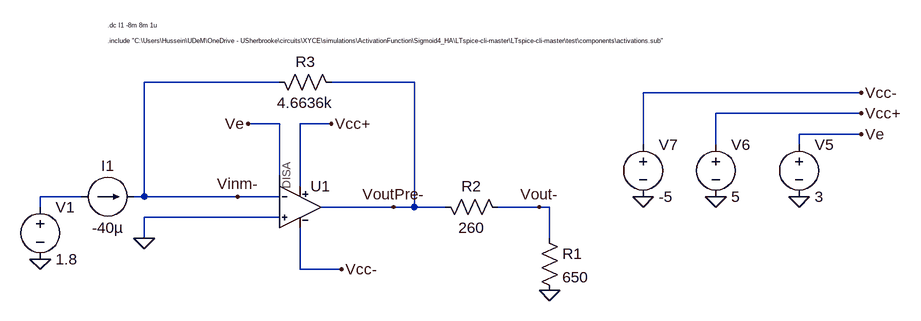
[diagram p0: schematic Test_TIA.asc]
Test_TIA.asc, the LTspice schematic file:
Version 4
SHEET 1 2360 680
WIRE 160 -128 -48 -128
WIRE 368 -128 240 -128
WIRE 1056 -112 720 -112
WIRE 1056 -80 832 -80
WIRE 160 -64 112 -64
WIRE 240 -64 192 -64
WIRE 1056 -48 960 -48
WIRE 720 -32 720 -112
WIRE 832 -32 832 -80
WIRE 960 -32 960 -48
WIRE 160 16 160 -64
WIRE 192 32 192 -64
WIRE -144 48 -208 48
WIRE -48 48 -48 -128
WIRE -48 48 -64 48
WIRE 96 48 -48 48
WIRE 160 48 96 48
WIRE -208 64 -208 48
WIRE 336 64 224 64
WIRE 368 64 368 -128
WIRE 368 64 336 64
WIRE 416 64 368 64
WIRE 560 64 496 64
WIRE 576 64 560 64
WIRE 160 80 -48 80
WIRE -48 112 -48 80
WIRE 576 112 576 64
WIRE 192 160 192 96
WIRE 256 160 192 160
FLAG -48 112 0
FLAG -208 144 0
FLAG 576 192 0
FLAG 560 64 Vout-
FLAG 336 64 VoutPre-
FLAG 96 48 Vinm-
FLAG 960 48 0
FLAG 832 48 0
FLAG 720 48 0
FLAG 1056 -112 Vcc-
FLAG 1056 -80 Vcc+
FLAG 1056 -48 Ve
FLAG 240 -64 Vcc+
FLAG 256 160 Vcc-
FLAG 112 -64 Ve
SYMBOL res 560 96 R0
SYMATTR InstName R1
SYMATTR Value 650
SYMBOL res 512 80 M270
WINDOW 0 32 56 VTop 2
WINDOW 3 0 56 VBottom 2
SYMATTR InstName R2
SYMATTR Value 260
SYMBOL res 256 -112 M270
WINDOW 0 32 56 VTop 2
WINDOW 3 0 56 VBottom 2
SYMATTR InstName R3
SYMATTR Value 4.6636k
SYMBOL current -144 48 M90
WINDOW 0 -32 40 VBottom 2
WINDOW 3 32 40 VTop 2
WINDOW 123 0 0 Left 0
WINDOW 39 0 0 Left 0
SYMATTR InstName I1
SYMATTR Value -40µ
SYMBOL voltage -208 48 R0
WINDOW 123 0 0 Left 0
WINDOW 39 0 0 Left 0
SYMATTR InstName V1
SYMATTR Value 1.8
SYMBOL MySym\\opamp2_custom 192 0 R0
WINDOW 3 16 96 Invisible 2
SYMATTR Value ""
SYMATTR InstName U1
SYMATTR SpiceModel OPA684_0
SYMBOL voltage 960 -48 R0
WINDOW 123 0 0 Left 0
WINDOW 39 0 0 Left 0
SYMATTR InstName V5
SYMATTR Value 3
SYMBOL voltage 832 -48 R0
WINDOW 123 0 0 Left 0
WINDOW 39 0 0 Left 0
SYMATTR InstName V6
SYMATTR Value 5
SYMBOL voltage 720 -48 R0
WINDOW 123 0 0 Left 0
WINDOW 39 0 0 Left 0
SYMATTR InstName V7
SYMATTR Value -5
TEXT -104 -192 Left 0 !.include "C:\\Users\\Hussein\\UDeM\\OneDrive - USherbrooke\\circuits\\XYCE\\simulations\\ActivationFunction\\Sigmoid4_HA\\LTspice-cli-master\\LTspice-cli-master\\test\\components\\activations.sub"
TEXT -104 -216 Left 0 !.dc I1 -8m 8m 1u

The netlist it stands for:
* Test_TIA.asc
R1 Vout- 0 650
R2 Vout- VoutPre- 260
R3 VoutPre- Vinm- 4.6636k
I1 N001 Vinm- -40µ
V1 N001 0 1.8
XU1 0 Vinm- Vcc+ Vcc- VoutPre- Ve OPA684_0  ; pins In+ In- V+ V- OUT DISA
V5 Ve 0 3
V6 Vcc+ 0 5
V7 Vcc- 0 -5
.include "C:\Users\Hussein\UDeM\OneDrive - USherbrooke\circuits\XYCE\simulations\ActivationFunction\Sigmoid4_HA\LTspice-cli-master\LTspice-cli-master\test\components\activations.sub"
.dc I1 -8m 8m 1u
.backanno
.end

* Results of the author's LTspice run, read from the files saved beside the schematic
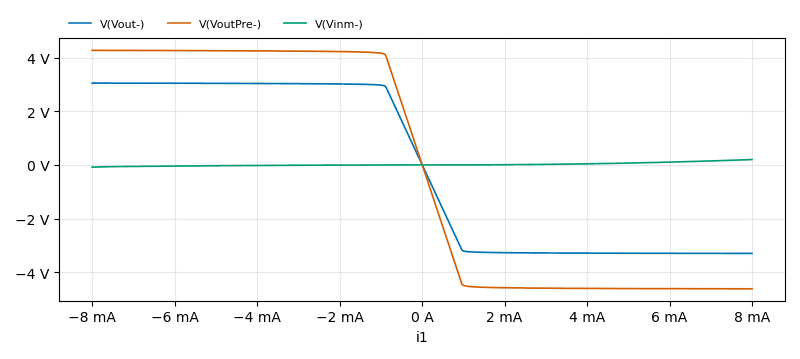
[diagram p1: DC transfer characteristic of Test_TIA.asc, plotted from the saved traces]
* DC transfer characteristic, 1 run:
*   V(Vout-): 3.049 V at i1=-8 mA, -3.296 V at i1=8 mA, min -3.296 V, max 3.049 V
*   V(VoutPre-): 4.268 V at i1=-8 mA, -4.614 V at i1=8 mA, min -4.614 V, max 4.268 V
*   V(Vinm-): -82.92 mV at i1=-8 mA, 201.1 mV at i1=8 mA, min -82.92 mV, max 201.1 mV